# EAGLE design FlickeringCandle (EAGLE 5.06)
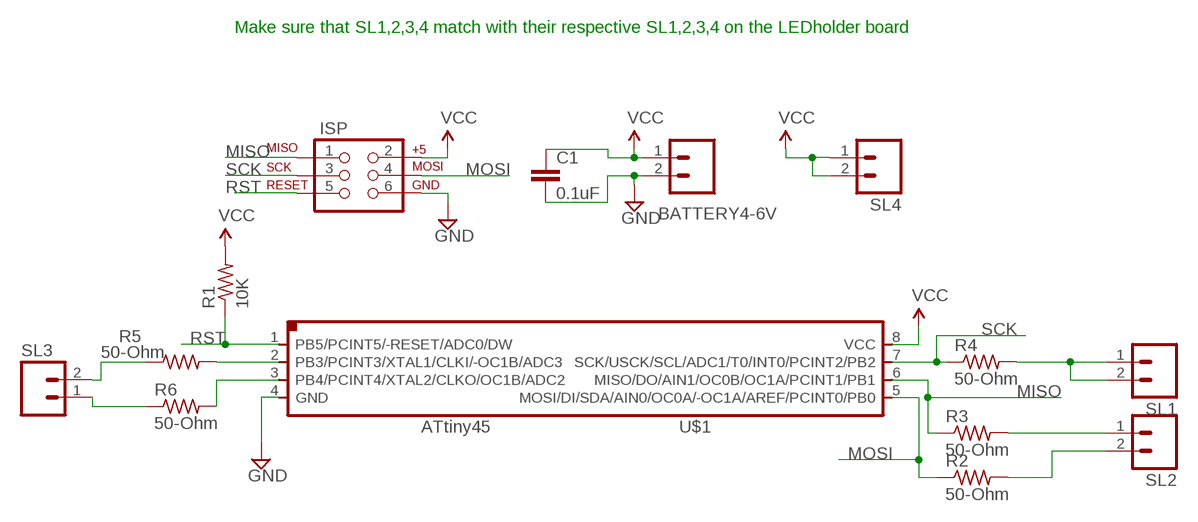
[diagram p0: schematic, sheet 1]

## Parts
BATTERY4-6V  M02  [02P]
C1  0.1uF  C-1206  [C1206]
ISP  AVR_SPI_PRG_6NS  [2X3-NS]
R1  10K  R-US_M0805  [M0805]
R2  50-Ohm  R-US_M0805  [M0805]
R3  50-Ohm  R-US_M0805  [M0805]
R4  50-Ohm  R-US_M0805  [M0805]
R5  50-Ohm  R-US_M0805  [M0805]
R6  50-Ohm  R-US_M0805  [M0805]
SL1  M02  [02P]
SL2  M02  [02P]
SL3  M02  [02P]
SL4  M02  [02P]
U$1  ATTINY13  ATTINY45SI  [SOIC8]

## Nets
GND: BATTERY4-6V.2 C1.2 ISP.6 U$1.4(GND)
MISO: ISP.1 R3.1 U$1.6(MISO/DO/AIN1/OC0B/OC1A/PCINT1/PB1)
MOSI: ISP.4 R2.1 U$1.5(MOSI/DI/SDA/AIN0/OC0A/-OC1A/AREF/PCINT0/PB0)
N$1: R4.2 SL1.1 SL1.2
N$2: R5.2 U$1.2(PB3/PCINT3/XTAL1/CLKI/-OC1B/ADC3)
N$3: R6.2 U$1.3(PB4/PCINT4/XTAL2/CLKO/OC1B/ADC2)
N$7: R6.1 SL3.1
N$9: R3.2 SL2.1
N$10: R2.2 SL2.2
N$11: R5.1 SL3.2
RST: ISP.5 R1.1 U$1.1(PB5/PCINT5/-RESET/ADC0/DW)
SCK: ISP.3 R4.1 U$1.7(SCK/USCK/SCL/ADC1/T0/INT0/PCINT2/PB2)
VCC: BATTERY4-6V.1 C1.1 ISP.2 R1.2 SL4.1 SL4.2 U$1.8(VCC)

## Notes on the sheet
- Make sure that SL1,2,3,4 match with their respective SL1,2,3,4 on the LEDholder board

## Library data of the parts
BATTERY4-6V SL1-SL4 = con-amp-quick:M02: AMP QUICK CONNECTOR
C1 = quantum-sensor:C: Capacitor
ISP = SparkFun:AVR_SPI_PRG_6: AVR ISP 6 Pin This is the reduced ISP connector for AVR programming. Common on Arduino. This footprint will take up less PCB space and can be used with a 10-pin to 6-pin adapter such as SKU: BOB-08508
R1-R6 = rcl:R-US_: RESISTOR, American symbol
U$1 = ng:ATTINY45

## Board
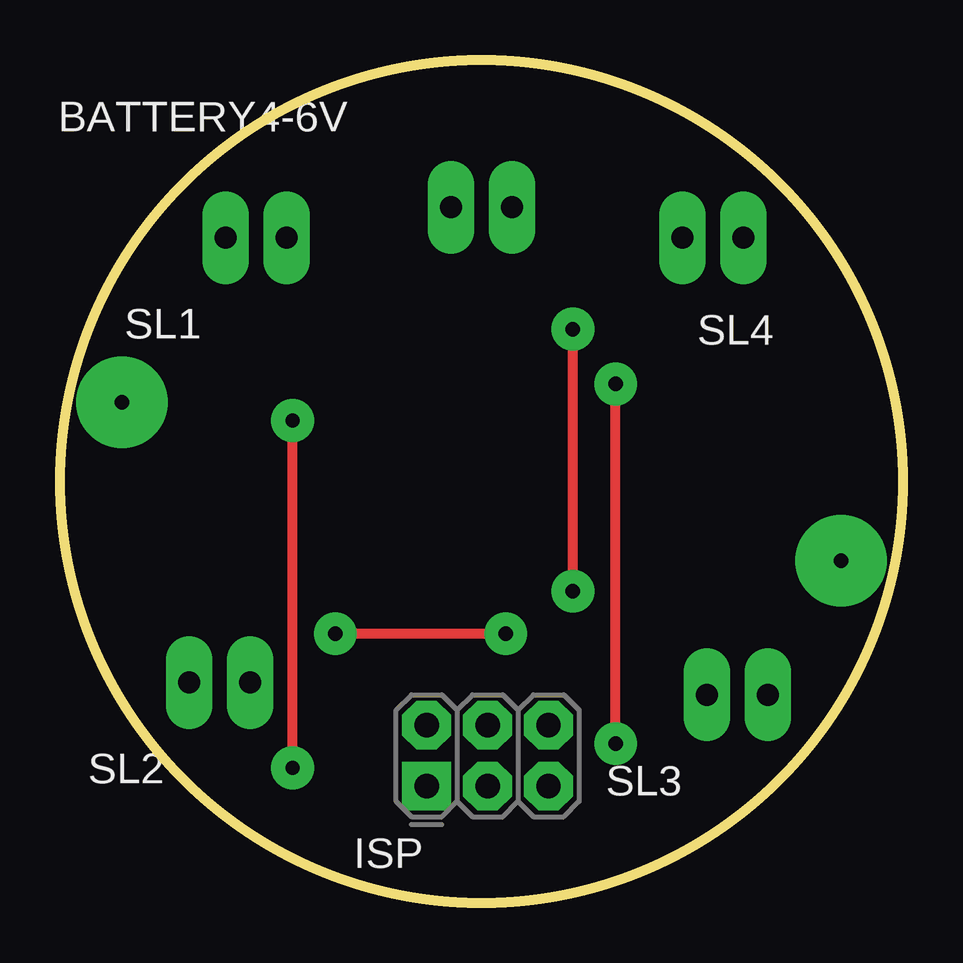
[diagram p1: board, top side]
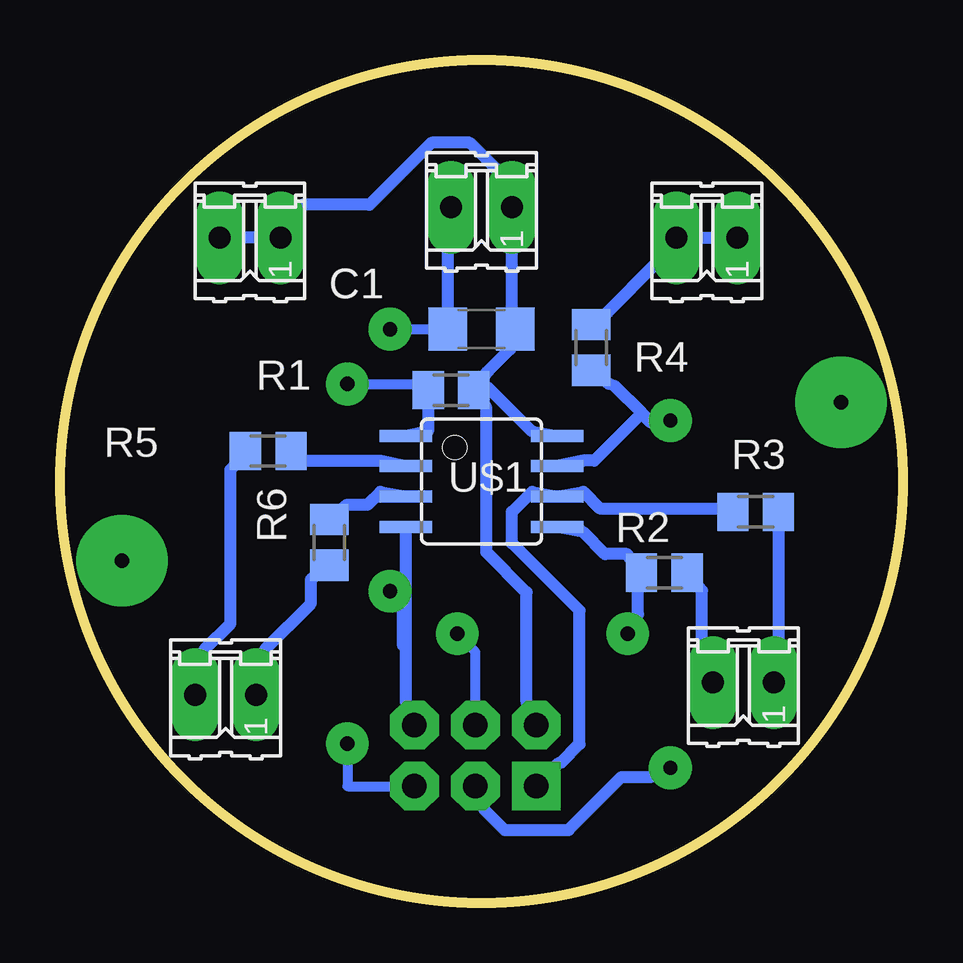
[diagram p2: board, bottom side, seen from below]

Size 35.14 x 35.14 mm. Coordinates in mm from the lower left corner, seen from the top.
Outline: circle at 17.57,17.57 radius 17.57
Copper layers (1*16): Top 0.035mm / dielectric 1.5mm / Bottom 0.035mm
Design rules "default": minimum track width 20mil, minimum drill 20mil, track to track 20mil, track to pad 20mil, pad to pad 20mil, via to via 20mil, smd to smd 20mil, copper to edge 40mil, drill to drill 20mil, minimum pad ring 20mil, minimum via ring 20mil, stop-mask expansion 4mil, vias tented up to drill 0mil, thermal gap 10mil

### Footprints (pad centres in the part's own frame; a part is rotated, then mirrored left to right if it is on the bottom)
02P = drill 0.914 long: 1 -1.27,0; 2 1.27,0
C1206 = smd 1.6 x 1.8: 1 -1.4,0; 2 1.4,0
2X3-NS = drill 1.016 square: 1 -2.54,-1.27 | drill 1.016 octagon: 2 -2.54,1.27; 3 0,-1.27; 4 0,1.27; 5 2.54,-1.27; 6 2.54,1.27
M0805 = smd 1.3 x 1.6: 1 -0.95,0; 2 0.95,0
SOIC8 = smd 0.5 x 2.2: 1 -1.905,-3.154; 2 -0.645,-3.154; 3 0.625,-3.154; 4 1.895,-3.154; 5 1.905,3.154; 6 0.635,3.154; 7 -0.635,3.154; 8 -1.905,3.154

### Placement (x,y rotation side)
BATTERY4-6V  17.57,29 180 bottom
C1  17.57,23.92 180 bottom
ISP  17.83,6.14 0 top
R1  18.84,21.38 0 bottom
R2  9.95,13.76 0 bottom
R3  6.14,16.3 0 bottom
R4  13,23.16 90 bottom
R5  26.46,18.84 0 bottom
R6  23.92,15.03 90 bottom
SL1  8.17,27.73 180 bottom
SL2  6.65,9.19 180 bottom
SL3  28.24,8.68 180 bottom
SL4  27.22,27.73 180 bottom
U$1  17.57,17.57 270 bottom

### Tracks (layer width: path | path; a pad name or v marks a point on that pad's centre or on a via)
GND  (via drill 0.6 pad 1.78)
  Top 0.406: v21.38,13 v21.38,23.92
  Bottom 0.406: v21.38,23.92 C1.2 | 20.72,10.71 20.87,10.71 20.87,13 v21.38,13
  Bottom 0.508: U$1.4 20.72,15.46 20.72,10.71 20.72,8.38 ISP.6 | C1.2 18.97,24.76 18.97,28.42 BATTERY4-6V.2
MISO
  Bottom 0.508: R3.1 7.69,16.45 12.64,16.45 13.33,17.14 U$1.6 15.46,17.14 16.3,16.3 16.3,15.01 13.48,12.19 13.48,6.62 14.24,5.86 14.32,5.86 ISP.1
MOSI  (via drill 0.6 pad 1.78)
  Top 0.406: v18.59,11.22 v11.48,11.22
  Bottom 0.406: ISP.4 17.83,10.46 v18.59,11.22 | R2.1 10.97,13.76
  Bottom 0.508: U$1.5 13.33,15.46 12.42,14.55 11.5,14.55 R2.1 11.04,13.02 11.04,12.03 v11.48,11.22
N$1
  Bottom 0.508: R4.2 12.26,24.68 10.36,26.59 SL1.2 SL1.1
N$2
  Bottom 0.508: R5.2 24.91,18.44 21.79,18.44 U$1.2
N$3
  Bottom 0.508: R6.2 23.16,16.61 22.32,16.61 21.79,17.14 U$1.3
N$4  (via drill 0.6 pad 3.81)
  other vias: 32.56,14.27
N$5  (via drill 0.6 pad 3.81)
  other vias: 2.59,20.87
N$7
  Bottom 0.508: R6.1 24.68,13.48 24.68,12.49 26.59,10.59 SL3.1
N$9
  Bottom 0.508: R3.2 5.18,15.54 5.18,11.04 SL2.1
N$10
  Bottom 0.508: R2.2 8.38,13.02 8.38,11.04 SL2.2
N$11
  Bottom 0.508: R5.1 28.04,18.05 28.04,11.65 29.1,10.59 SL3.2
RST  (via drill 0.6 pad 1.78)
  Top 0.406: v23.16,6.65 v23.16,21.64
  Bottom 0.406: ISP.5 23.16,4.87 v23.16,6.65 | R1.1 19.86,21.38 19.86,21.64 v23.16,21.64
  Bottom 0.508: R1.1 19.81,20.64 19.81,19.65 U$1.1
SCK  (via drill 0.6 pad 1.78)
  Top 0.406: v9.7,5.63 v9.7,20.11
  Bottom 0.508: R4.1 12.26,21.64 12.03,21.56 10.89,20.42 | 10.89,20.42 10.51,20.04 v9.7,20.11 | 10.89,20.42 12.87,18.44 13.33,18.44 U$1.7 | v9.7,5.63 10.51,5.25 11.73,5.25 13.94,3.04 16.61,3.04 17.44,3.88 ISP.3
VCC
  Bottom 0.508: R1.2 17.29,22.17 16.38,23.08 C1.1 16.3,24.76 BATTERY4-6V.1 16.99,30.63 18.05,31.69 19.65,31.69 22.25,29.1 25.06,29.1 SL4.1 SL4.2 | U$1.8 15.46,19.65 17.29,21.48 R1.2 | ISP.2 15.69,8.38 15.69,12.95 17.37,14.63 17.37,20.64 R1.2